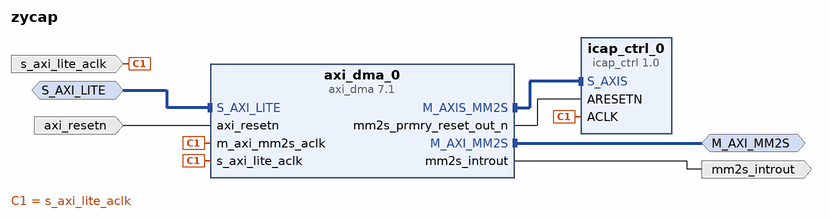
[diagram p0: block diagram of the top level]
# Vivado block design zycap, xc7z020clg484-1, Vivado 2018.3
create_bd_design zycap

create_bd_intf_port -mode Slave -vlnv xilinx.com:interface:aximm_rtl:1.0 S_AXI_LITE
set_property -dict [list \
  CONFIG.ADDR_WIDTH 32 \
  CONFIG.ARUSER_WIDTH 0 \
  CONFIG.AWUSER_WIDTH 0 \
  CONFIG.BUSER_WIDTH 0 \
  CONFIG.DATA_WIDTH 32 \
  CONFIG.FREQ_HZ 100000000 \
  CONFIG.HAS_BRESP 1 \
  CONFIG.HAS_BURST 1 \
  CONFIG.HAS_CACHE 1 \
  CONFIG.HAS_LOCK 1 \
  CONFIG.HAS_PROT 1 \
  CONFIG.HAS_QOS 1 \
  CONFIG.HAS_REGION 1 \
  CONFIG.HAS_RRESP 1 \
  CONFIG.HAS_WSTRB 1 \
  CONFIG.ID_WIDTH 0 \
  CONFIG.MAX_BURST_LENGTH 1 \
  CONFIG.NUM_READ_OUTSTANDING 1 \
  CONFIG.NUM_READ_THREADS 1 \
  CONFIG.NUM_WRITE_OUTSTANDING 1 \
  CONFIG.NUM_WRITE_THREADS 1 \
  CONFIG.PHASE 0.000 \
  CONFIG.PROTOCOL AXI4LITE \
  CONFIG.READ_WRITE_MODE READ_WRITE \
  CONFIG.RUSER_BITS_PER_BYTE 0 \
  CONFIG.RUSER_WIDTH 0 \
  CONFIG.SUPPORTS_NARROW_BURST 0 \
  CONFIG.WUSER_BITS_PER_BYTE 0 \
  CONFIG.WUSER_WIDTH 0 \
] [get_bd_intf_ports S_AXI_LITE]
create_bd_intf_port -mode Master -vlnv xilinx.com:interface:aximm_rtl:1.0 M_AXI_MM2S
set_property -dict {CONFIG.ADDR_WIDTH 32 CONFIG.DATA_WIDTH 32 CONFIG.PROTOCOL AXI4} [get_bd_intf_ports M_AXI_MM2S]
create_bd_port -dir I -type rst axi_resetn
create_bd_port -dir I -type clk s_axi_lite_aclk
create_bd_port -dir O -type intr mm2s_introut

create_bd_cell -type ip -vlnv shs.ntu:zycap:icap_ctrl:1.0 icap_ctrl_0
create_bd_cell -type ip -vlnv xilinx.com:ip:axi_dma:7.1 axi_dma_0
set_property -dict [list \
  CONFIG.c_include_s2mm 0 \
  CONFIG.c_include_sg 0 \
  CONFIG.c_mm2s_burst_size 256 \
  CONFIG.c_sg_length_width 23 \
] [get_bd_cells axi_dma_0]

# ---- connections ----

connect_bd_intf_net [get_bd_intf_ports S_AXI_LITE] [get_bd_intf_pins axi_dma_0/S_AXI_LITE]
connect_bd_intf_net [get_bd_intf_pins axi_dma_0/M_AXIS_MM2S] [get_bd_intf_pins icap_ctrl_0/S_AXIS]
connect_bd_intf_net [get_bd_intf_ports M_AXI_MM2S] [get_bd_intf_pins axi_dma_0/M_AXI_MM2S]
connect_bd_net [get_bd_ports axi_resetn] [get_bd_pins axi_dma_0/axi_resetn]
connect_bd_net [get_bd_ports s_axi_lite_aclk] \
  [get_bd_pins icap_ctrl_0/ACLK] [get_bd_pins axi_dma_0/s_axi_lite_aclk] [get_bd_pins axi_dma_0/m_axi_mm2s_aclk]
connect_bd_net [get_bd_pins axi_dma_0/mm2s_introut] [get_bd_ports mm2s_introut]
connect_bd_net [get_bd_pins axi_dma_0/mm2s_prmry_reset_out_n] [get_bd_pins icap_ctrl_0/ARESETN]

# ---- address map ----
assign_bd_address -offset 0x00000000 -range 512M -target_address_space [get_bd_addr_spaces axi_dma_0/Data_MM2S] [get_bd_addr_segs M_AXI_MM2S/Reg]
assign_bd_address -offset 0x40400000 -range 64K -target_address_space [get_bd_addr_spaces S_AXI_LITE] [get_bd_addr_segs axi_dma_0/S_AXI_LITE/Reg]

validate_bd_design
save_bd_design
